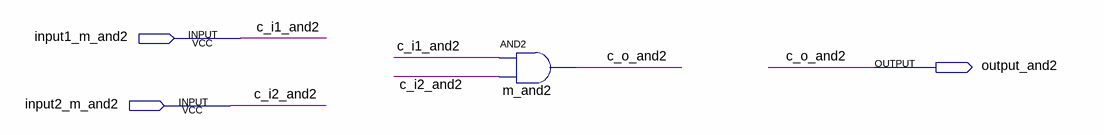
[diagram p0: schematic sheet]
// Quartus schematic minha_and2.bdf as structural Verilog: 1 symbols, 3 pins
module minha_and2 (
  input  input1_m_and2,
  input  input2_m_and2,
  output output_and2
);

  and m_and2 (output_and2, input1_m_and2, input2_m_and2);

  // Other names for the same wires on the sheet: c_i1_and2 = input1_m_and2; c_i2_and2 = input2_m_and2;
  //   c_o_and2 = output_and2
endmodule
